# EAGLE design Qwiic_TMP117 (EAGLE 9.3.0)
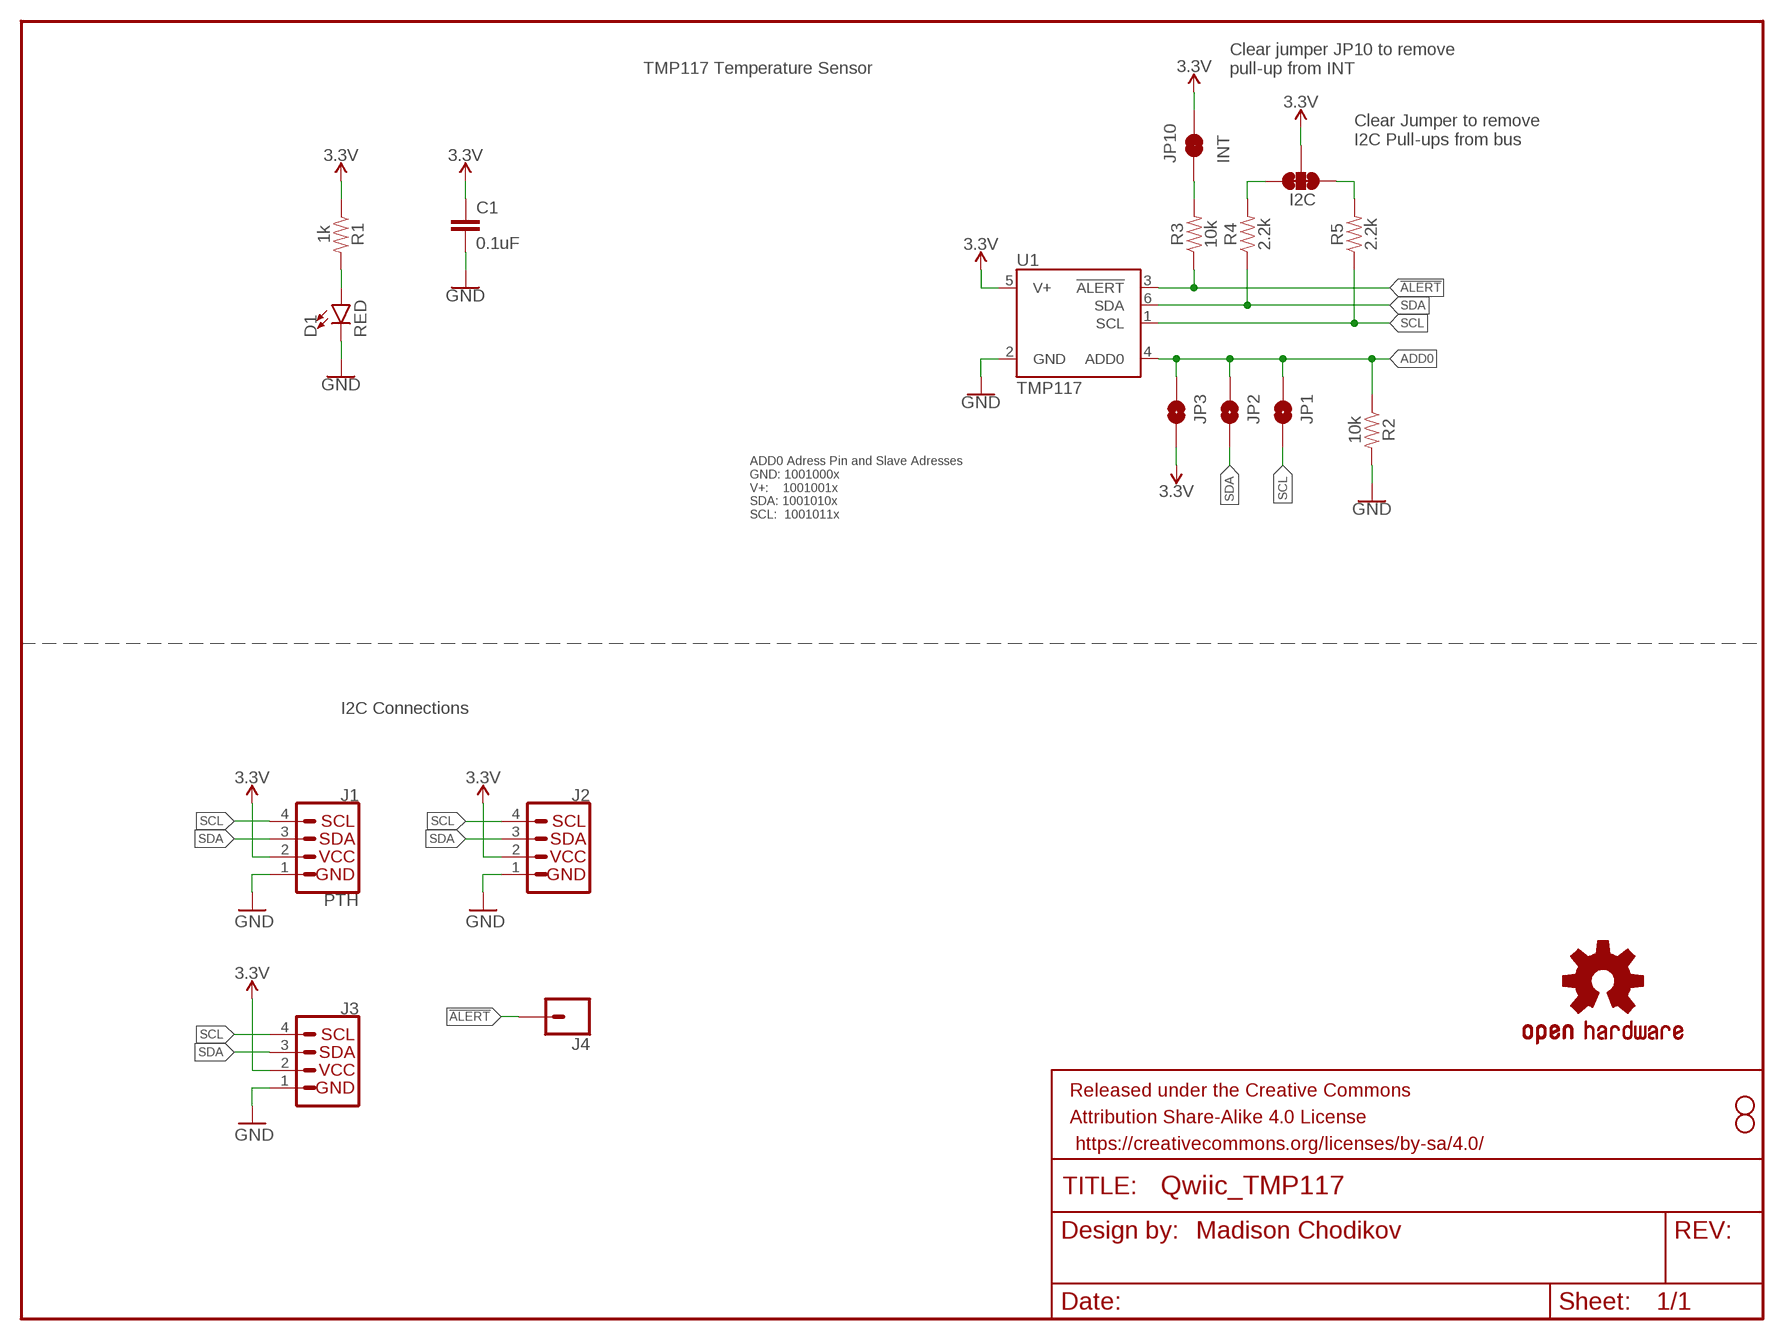
[diagram p0: schematic, sheet 1]

## Parts
C1  0.1uF  0.1UF-0603-25V-(+80/-20%)  [0603]
D1  RED  LED-RED0603  [LED-0603]
FRAME1  FRAME-LETTER  [CREATIVE_COMMONS]
I2C  JUMPER-SMT_3_2-NC_TRACE_SILK  [SMT-JUMPER_3_2-NC_TRACE_SILK]
J1  PTH  I2C_STANDARD_NO_SILK  [1X04_NO_SILK]
J2  QWIIC_CONNECTORJS-1MM  [JST04_1MM_RA]
J3  QWIIC_CONNECTORJS-1MM  [JST04_1MM_RA]
J4  CONN_01PTH_NO_SILK_YES_STOP  [1X01_NO_SILK]
JP1  JUMPER-SMT_2_NO_SILK  [SMT-JUMPER_2_NO_SILK]
JP2  JUMPER-SMT_2_NO_SILK  [SMT-JUMPER_2_NO_SILK]
JP3  JUMPER-SMT_2_NO_SILK  [SMT-JUMPER_2_NO_SILK]
JP8  STAND-OFF  [STAND-OFF]
JP9  STAND-OFF  [STAND-OFF]
JP10  INT  JUMPER-PAD-2-NC_BY_TRACE  [PAD-JUMPER-2-NC_BY_TRACE_YES_SILK]
LOGO1  OSHW-LOGOMINI  [OSHW-LOGO-MINI]
R1  1k  1KOHM-0603-1/10W-1%  [0603]
R2  10k  10KOHM-0603-1/10W-1%  [0603]
R3  10k  10KOHM-0603-1/10W-1%  [0603]
R4  2.2k  2.2KOHM-0603-1/10W-1%  [0603]
R5  2.2k  2.2KOHM-0603-1/10W-1%  [0603]
U1  TMP117  [TMP117]

## Nets
3.3V: C1.1 I2C.2 J1.2(VCC) J2.2 J3.2 JP3.2 JP10.2 R1.1 U1.5(V+)
!ALERT: J4.1 R3.1 U1.3(!ALERT)
ADD0: JP1.1 JP2.1 JP3.1 R2.1 U1.4(ADD0)
GND: C1.2 D1.C J1.1(GND) J2.1 J3.1 R2.2 U1.2(GND)
N$1: D1.A R1.2
N$2: I2C.1 R5.2
N$3: I2C.3 R4.2
N$4: JP10.1 R3.2
SCL: J1.4(SCL) J2.4 J3.4 JP1.2 R5.1 U1.1(SCL)
SDA: J1.3(SDA) J2.3 J3.3 JP2.2 R4.1 U1.6(SDA)

## Notes on the sheet
- TMP117 Temperature Sensor
- Clear jumper JP10 to remove 
  pull-up from INT
- Clear Jumper to remove 
  I2C Pull-ups from bus
- ADD0 Adress Pin and Slave Adresses
  GND: 1001000x
  V+:    1001001x
  SDA: 1001010x
  SCL:  1001011x
- I2C Connections
- Madison Chodikov

## Library data of the parts
C1 = SparkFun-Capacitors:0.1UF: 0.1µF ceramic capacitors A capacitor is a passive two-terminal electrical component used to store electrical energy temporarily in an electric field.; PROD_ID: CAP-00810
D1 = SparkFun-LED:LED-RED: Red SMD LED Used in manufacturing of most products at SparkFun Packages: 0603 - SMD 0603 package [Product Link] <http://docs.avagotech.com/docs/AV02-0551EN> 0603 SMART - SMD 0603 SMART package ( more efficient and expensive)[Product Link] <http://www.osram-os.com/Graphics/XPic2/00077099_0.pdf> 1206 - SMD1206 package [Product Link] <https://www.sparkfun.com/datasheets/DevTools/LilyPad/Q150OVS4.pdff> SparkFun Products: Pro Mini 328 -5V <https://www.sparkfun.com/products/821> RedBoard <https://www.sparkfun.com/products/12757> IOIO-OTG <https://www.sparkfun.com/products/13613>; PROD_ID: DIO-00819
FRAME1 = SparkFun-Aesthetics:FRAME-LETTER: Schematic Frame - Letter Standard 8.5x11 US Letter frame
I2C = SparkFun-Jumpers:JUMPER-SMT_3_2-NC_TRACE: Normally closed trace jumper (2 of 2 connections) This jumper has a trace between all three pads so they are normally closed (NC). Use a razor knife to open the connection(s). For best results follow the IPC guidelines for cutting traces: Cutout at least 0.063 mm (0.005 in). Remove all loose material to clean up the cut area. Seal the cut with an approved epoxy. Reapply solder to reclose the connection(s).
J1 = SparkX:I2C_STANDARD: SparkFun I2C Standard Pinout Header SparkFun has standardized on a pinout for all I2C based sensor breakouts. This pinout allows I2C boards to be plugged directly into the headers on Arduino Uno compatible boards, and to be daisy chained easily. Example SparkFun Products: SparkFun Atmospheric Sensor Breakout - BME280 <https://www.sparkfun.com/products/13676> SparkFun Altitude/Pressure Sensor Breakout - MPL3115A2 <https://www.sparkfun.com/products/11084> SparkFun TOF Range Finder Sensor - VL6180 <https://www.sparkfun.com/products/12785>
J2 J3 = SparkFun-Connectors:QWIIC_CONNECTOR: SparkFun I2C Standard Qwiic Connector An SMD 1mm pitch JST connector makes it easy and quick (get it? Qwiic?) to connect I2C devices to each other. The Qwiic system <http://www.sparkfun.com/qwiic> enables fast and solderless connection between popular platforms and various sensors and actuators. We carry 200mm <https://www.sparkfun.com/products/14204>, 100mm <https://www.sparkfun.com/products/14205>, 50mm <https://www.sparkfun.com/products/14206>, and breadboard friendly <https://www.sparkfun.com/products/14207> Qwiic cables. We also offer 10 pcs strips <https://www.sparkfun.com/products/14323> the SMD connectors.; PROD_ID: CONN-13694
J4 = SparkFun-Connectors:CONN_01: Single connection point. Often used as Generic Header-pin footprint for 0.1 inch spaced/style header connections On any of the 0.1 inch spaced packages, you can populate with these: Break Away Headers - Straight <https://www.sparkfun.com/products/116> (PRT-00116) Break Away Male Headers - Right Angle <https://www.sparkfun.com/products/553> (PRT-00553) Female Headers <https://www.sparkfun.com/products/115> (PRT-00115) Break Away Headers - Machine Pin <https://www.sparkfun.com/products/117> (PRT-00117) Break Away Female Headers - Swiss Machine Pin <https://www.sparkfun.com/products/743> (PRT-00743) This device is also useful as a general connection point to wire up your design to another part of your project. Our various solder wires solder well into these plated through hole pads. Hook-Up Wire - Assortment (Stranded, 22 AWG) <https://www.sparkfun.com/products/11375> (PRT-11375) Hook-Up Wire - Assortment (Solid Core, 22 AWG) <https://www.sparkfun.com/products/11367> (PRT-11367) View the entire wire category on our website here <https://www.sparkfun.com/categories/141> Special notes: SMTSO-256-ET is a "flush mount" nut for a 4-40 screw. We mostly use this on specialty testbeds; it is a nice way to connect hardware to your PCB at an adjustable hieght. Also note, the SNAP packages are for using a snappable style connector. We sell a baggie of snaps and they are also used on two LilyPad designs: Snap Assortment - 30 pack (male and female) <https://www.sparkfun.com/products/11347> (DEV-11347) LilyPad Arduino SimpleSnap <https://www.sparkfun.com/products/10941> (DEV-10941) LilyPad SimpleSnap Protoboard <https://www.sparkfun.com/products/10940> (DEV-10940)
JP1-JP3 = SparkFun-Jumpers:JUMPER-SMT_2_NO: Normally open jumper This jumper has two pads in close proximity to each other. Apply solder to close the connection. Round pads are easier to solder for beginners, but are a lot larger. SparkFun Product that uses the round pads: SparkFun EL Sequencer <https://www.sparkfun.com/products/12781>
JP8 JP9 = SparkFun:STAND-OFF: Stand Off This is the mechanical footprint for a #4 phillips button head screw. Use the keepout ring to avoid running the screw head into surrounding components. SKU : PRT-00447
JP10 = SparkFun-Passives:JUMPER-PAD-2-NC_BY_TRACE
LOGO1 = SparkFun-Aesthetics:OSHW-LOGO: Open-Source Hardware (OSHW) Logo This logo indicates the piece of hardware it is found on incorporates a OSHW license and/or adheres to the definition of open source hardware found here: http://freedomdefined.org/OSHW
R1 = SparkFun-Resistors:1KOHM: 1kΩ resistor A resistor is a passive two-terminal electrical component that implements electrical resistance as a circuit element. Resistors act to reduce current flow, and, at the same time, act to lower voltage levels within circuits. - Wikipedia; PROD_ID: RES-07856
R2 R3 = SparkFun-Resistors:10KOHM: 10kΩ resistor A resistor is a passive two-terminal electrical component that implements electrical resistance as a circuit element. Resistors act to reduce current flow, and, at the same time, act to lower voltage levels within circuits. - Wikipedia; PROD_ID: RES-00824
R4 R5 = SparkFun-Resistors:2.2KOHM: 2.2kΩ resistor A resistor is a passive two-terminal electrical component that implements electrical resistance as a circuit element. Resistors act to reduce current flow, and, at the same time, act to lower voltage levels within circuits. - Wikipedia; PROD_ID: RES-08272
U1 = my-library:TMP117: Temperature Sensor TMP117x High-Accuracy, Low-Power, Digital Temperature Sensor With SMBus™- and I2C-Compatible Interface

## Board
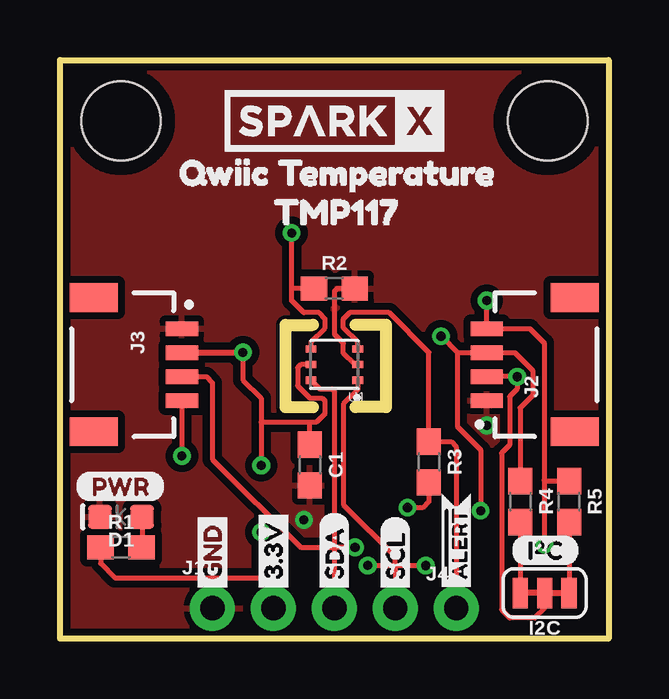
[diagram p1: board, top side]
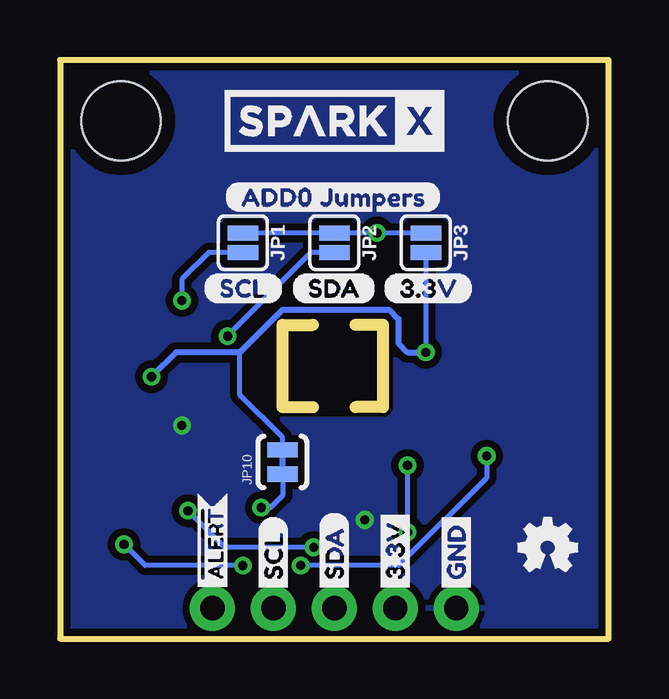
[diagram p2: board, bottom side, seen from below]

Size 22.86 x 24.13 mm. Coordinates in mm from the lower left corner, seen from the top.
Outline: 0,0 0,24.13 22.86,24.13 22.86,0 0,0
Copper layers (1*16): Top 0.035mm / dielectric 1.5mm / Bottom 0.035mm
Design rules "SparkFun-2-layer-TIGHT": minimum track width 7mil, minimum drill 15mil, track to track 7mil, track to pad 7mil, pad to pad 7mil, via to via 7mil, smd to smd 7mil, copper to edge 7mil, drill to drill 7mil, minimum pad ring 7mil, minimum via ring 7mil, stop-mask expansion 4mil, vias tented up to drill 25mil, thermal gap 10mil
tRestrict: area 9.4,9.7 to 13.6,13.1
bRestrict: area 9.4,9.7 to 13.6,13.1
Milling: 6 lines

### Footprints (pad centres in the part's own frame; a part is rotated, then mirrored left to right if it is on the bottom)
0603 = smd 1.1 x 1: 1 -0.85,0; 2 0.85,0
LED-0603 = smd 1 x 1: A -0.877,0; C 0.877,0
SMT-JUMPER_3_2-NC_TRACE_SILK = smd 0.635 x 1.27: 1 -1.016,0; 2 0,0; 3 1.016,0
1X04_NO_SILK = drill 1.016 pad 1.88: 1 0,0; 2 2.54,0; 3 5.08,0; 4 7.62,0
JST04_1MM_RA = smd 0.6 x 1.35: 1 -1.5,0; 2 -0.5,0; 3 0.5,0; 4 1.5,0 | smd 1.2 x 2: NC1 2.8,-3.675; NC2 -2.8,-3.675
1X01_NO_SILK = drill 1.016 pad 1.88: 1 0,0
SMT-JUMPER_2_NO_SILK = smd 0.635 x 1.27: 1 -0.406,0; 2 0.406,0
STAND-OFF = hole 3.302: 0,0
PAD-JUMPER-2-NC_BY_TRACE_YES_SILK = smd 0.635 x 1.27: 1 -0.508,0; 2 0.508,0
TMP117 = smd 0.45 x 0.3: 1 -0.975,0.65; 2 -0.975,0; 3 -0.975,-0.65; 4 0.975,-0.65; 5 0.975,0; 6 0.975,0.65

### Placement (x,y rotation side)
C1  10.41,7.24 270 top
D1  2.54,5.08 180 top
FRAME1  -7.62,-8.89 0 top  (outside the outline)
I2C  20.19,1.91 180 top
J1  6.35,1.27 0 top
J2  17.78,11.43 90 top
J3  5.08,11.43 270 top
J4  16.51,1.27 0 top
JP1  15.24,16.51 270 bottom
JP2  11.43,16.51 270 bottom
JP3  7.62,16.51 270 bottom
JP8  20.32,21.59 0 top
JP9  2.54,21.59 0 top
JP10  13.59,7.37 90 bottom
LOGO1  2.54,3.81 0 bottom
R1  2.54,3.81 0 top
R2  11.43,14.61 0 top
R3  15.37,7.37 270 top
R4  19.18,5.71 270 top
R5  21.21,5.71 270 top
U1  11.43,11.43 180 top
U$1  [ADD0_JUMPERS0]  16,18.41 0 bottom
U$2  [SPARKX-MEDIUM]  11.43,21.59 0 bottom
U$4  [TMP1171]  8,17.78 0 top
U$5  [3#3V2]  9.4,14.61 0 bottom
U$6  [QWIIC_TEMPERATURE2]  4.06,19.43 0 top
U$7  [#ALERT0]  16.51,1.65 90 bottom
U$8  [SCL1]  16.89,14.61 0 bottom
U$9  [3#3V5]  8.89,1.78 90 top
U$10  [GND4]  6.35,1.78 90 top
U$11  [3#3V5]  8.89,1.78 90 bottom
U$12  [GND4]  6.35,1.78 90 bottom
U$13  [SCL7]  13.97,1.78 90 top
U$14  [SDA6]  11.43,1.78 90 top
U$15  [SDA6]  11.43,1.78 90 bottom
U$16  [SCL7]  13.97,1.78 90 bottom
U$17  [SPARKX-MEDIUM]  11.43,21.59 0 top
U$18  [SDA0]  13.21,14.61 0 bottom
U$19  [I_SUPER2_C-()-03]  18.8,3.68 0 top
U$20  [#ALERT0]  16.51,1.65 90 top
U$21  [PWR-()-03]  0.64,6.35 0 top

### Tracks (layer width: path | path; a pad name or v marks a point on that pad's centre or on a via)
3.3V  (via drill 0.38)
  Top 0.203: 10.41,9.02 10.67,9.02 11.05,9.4 11.05,9.91 10.92,10.03 10.41,10.03 9.91,10.54 9.91,11.3 10.03,11.43 U1.5 | 10.41,9.02 8.38,9.02 | C1.1 10.41,9.02 | 8.38,9.02 v8.38,7.23 | J2.2 v19.05,10.92 19.05,10.41 18.73,10.1 18.73,8.08 18.4,7.74 18.4,1.21 18.74,0.86 19.79,0.86 20.19,1.27 I2C.2 | v8.38,4.45 8.38,2.54 | J1.2 8.89,2.03 8.38,2.54 | R1.1 1.69,3.14 2.29,2.54 8.38,2.54 | 8.38,9.02 8.38,10.03 7.62,10.79 v7.62,11.94
  Top 0.254: v7.62,11.94 v7.61,11.93 J3.2
  Bottom 0.203: JP3.2 v7.62,11.94 | 15.37,11.94 15.37,10.16 13.59,8.38 JP10.2 | v8.38,7.23 v8.38,4.45
  Bottom 0.254: v19.05,10.92 18.03,11.94 15.37,11.94 13.59,13.72 9.14,13.72 8.76,13.34 8.76,12.32 8.38,11.94 v7.62,11.94
!ALERT
  Top 0.203: U1.3 12.4,12.36 11.81,12.95 11.81,13.34 12.06,13.59 13.72,13.59 15.37,11.94 R3.1 16.3,8.22 16.51,8 J4.1
ADD0  (via drill 0.38)
  Top 0.203: U1.4 10.46,12.36 11.05,12.95 11.05,13.34 10.79,13.59 10.16,13.59 9.65,14.1 9.65,14.61 | 9.65,14.61 v9.65,16.92 | R2.1 9.65,14.61
  Bottom 0.203: JP3.1 v9.65,16.92 JP2.1 JP1.1
GND  (via drill 0.38)
  Top 0.203: U1.2 12.28,11.43 11.81,11.9 11.81,12.32 11.43,12.7 11.43,14.48 11.56,14.61 R2.2
  other vias: 10.16,4.95 17.78,8.89
  pour Top (isolate 0.305): 0,0 0,24.13 22.86,24.13 22.86,0
  pour Top (isolate 0.305): 22.86,0 22.86,24.13 0,24.13 0,0
  pour Top (isolate 0.305): 0,0 0,24.13 22.86,24.13 22.86,0
  pour Top (isolate 0.305): 22.86,24.13 0,24.13 0,0 22.86,0
  pour Top (isolate 0.305): 0,0 22.86,0 22.86,24.13 0,24.13
  pour Top (isolate 0.305): 22.86,24.13 0,24.13 0,0 22.86,0
  pour Top (isolate 0.305): 0,0 0,24.13 22.86,24.13 22.86,0
  pour Bottom (isolate 0.305): 22.86,0 22.86,24.13 0,24.13 0,0
  pour Top (isolate 0.305): 0,0 0,24.13 22.86,24.13 22.86,0
N$1
  Top 0.203: D1.A 3.42,3.84 R1.2
N$2
  Top 0.203: R5.2 I2C.1
N$3
  Top 0.203: R4.2 I2C.3
N$4  (via drill 0.38)
  Top 0.203: R3.2 15.37,5.71 15.11,5.46 v14.48,5.46
  Bottom 0.203: v14.48,5.46 14.1,5.46 13.59,5.97 JP10.1
SCL  (via drill 0.38)
  Top 0.203: v17.78,14.1 J2.4 19.58,12.93 20.18,12.34 20.18,6.6 | U1.1 12.4,10.37 11.81,9.78 11.81,5.59 13.97,3.43 13.97,3.05 | 13.97,3.05 J1.4 | J3.4 v5.08,7.62 | v12.82,3.05 13.97,3.05 | 13.97,3.05 v15.24,3.05 | v20.19,3.93 20.18,3.95 20.18,6.6 | R5.1 20.21,6.57 20.18,6.6
  Bottom 0.203: v17.78,14.1 17.78,14.99 16.66,16.1 JP1.2 | v12.82,3.05 8.74,3.05 5.08,6.7 v5.08,7.62 | v15.24,3.05 19.31,3.05 v20.19,3.93
SDA  (via drill 0.38)
  Top 0.203: R4.1 19.18,9.62 19.7,10.15 19.7,11.19 18.96,11.93 J2.3 16.76,11.93 | U1.6 10.82,10.41 11.33,10.41 11.43,10.32 11.43,3.81 | 11.43,3.81 J1.3 | 11.43,3.81 10.02,3.81 6.35,7.48 6.35,10.67 6.1,10.92 J3.3 | v12.29,3.81 11.43,3.81 | 16.78,11.91 16.76,11.93 | 16.56,11.93 16.76,11.93 | v15.88,12.61 16.56,11.93 | 16.56,11.93 16.56,8.84 17.53,7.87 v17.53,5.33
  Bottom 0.203: JP2.2 12.41,16.1 15.88,12.64 v15.88,12.61 | v12.29,3.81 16,3.81 v17.53,5.33

### Text on the board
tDocu: Madison Chodikov